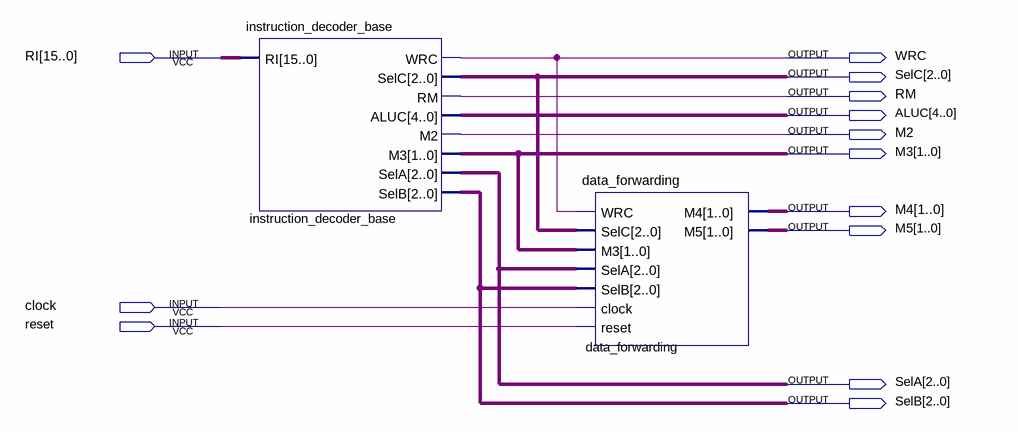
[diagram p0: schematic sheet]
// Quartus schematic instruction_decoder.bdf as structural Verilog: 2 symbols, 13 pins
module instruction_decoder (
  input  [15:0] RI,
  input  clock,
  input  reset,
  output WRC,
  output [2:0] SelC,
  output RM,
  output [4:0] ALUC,
  output M2,
  output [1:0] M3,
  output [1:0] M4,
  output [1:0] M5,
  output [2:0] SelA,
  output [2:0] SelB
);

  instruction_decoder_base instruction_decoder_base (
    .RI(RI), .WRC(WRC), .SelC(SelC), .RM(RM), .ALUC(ALUC), .M2(M2), .M3(M3), .SelA(SelA), .SelB(SelB));
  data_forwarding data_forwarding (
    .WRC(WRC), .SelC(SelC), .M3(M3), .SelA(SelA), .SelB(SelB), .clock(clock), .reset(reset), .M4(M4), .M5(M5));
endmodule
